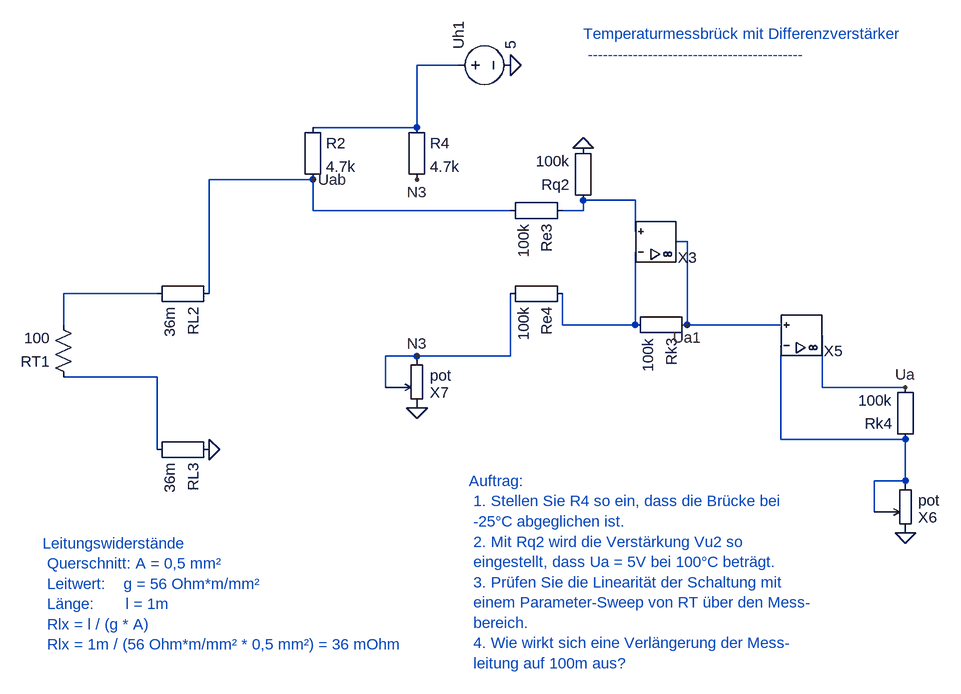
[diagram p0: schematic 1_3_2_PT100-Sensor_mit_Brueckenschaltung.asc]
1_3_2_PT100-Sensor_mit_Brueckenschaltung.asc, the LTspice schematic file:
Version 4
SHEET 1 880 680
WIRE 480 288 320 288
WIRE 320 288 320 464
WIRE 480 288 480 336
WIRE 480 336 784 336
WIRE 640 560 592 560
WIRE 592 560 592 608
WIRE 640 560 784 560
WIRE 784 560 784 464
WIRE 1200 544 1200 688
WIRE 1200 688 1392 688
WIRE 1392 688 1392 752
WIRE 1392 752 1344 752
WIRE 1344 752 1344 800
WIRE 704 112 640 112
WIRE 640 112 640 208
WIRE 640 208 480 208
WIRE 1056 512 1056 384
WIRE 1056 384 1040 384
WIRE 1056 512 1200 512
WIRE 96 592 240 592
WIRE 240 592 240 704
WIRE 976 512 976 400
WIRE 976 512 864 512
WIRE 864 512 864 464
WIRE 1392 608 1264 608
WIRE 1264 608 1264 528
WIRE 240 464 96 464
WIRE 96 464 96 512
WIRE 864 336 896 336
WIRE 896 336 896 320
WIRE 896 320 976 320
WIRE 976 320 976 368
FLAG 784 112 0
FLAG 896 240 0
FLAG 1392 832 0
FLAG 320 704 0
FLAG 640 640 0
FLAG 640 560 N3
FLAG 640 288 N3
FLAG 1056 512 Ua1
FLAG 1392 608 Ua
FLAG 480 288 Uab
SYMBOL opamp 1008 384 M180
SYMATTR InstName X3
SYMATTR Prefix X
SYMATTR SpiceModel opamp
SYMBOL res 112 608 R180
SYMATTR InstName RT1
SYMATTR Value 100
SYMBOL Misc\EuropeanResistor 336 448 R90
SYMATTR InstName RL2
SYMATTR Value 36m
SYMBOL Misc\EuropeanResistor 336 688 R90
SYMATTR InstName RL3
SYMATTR Value 36m
SYMBOL Misc\EuropeanResistor 880 320 R90
SYMATTR InstName Re3
SYMATTR Value 100k
SYMBOL voltage 688 112 R270
SYMATTR InstName Uh1
SYMATTR Value 5
SYMBOL Misc\EuropeanResistor 464 192 R0
SYMATTR InstName R2
SYMATTR Value 4.7k
SYMBOL Misc\EuropeanResistor 624 192 R0
SYMATTR InstName R4
SYMATTR Value 4.7k
SYMBOL Misc\EuropeanResistor 912 336 R180
SYMATTR InstName Rq2
SYMATTR Value 100k
SYMBOL Misc\EuropeanResistor 1072 496 R90
SYMATTR InstName Rk3
SYMATTR Value 100k
SYMBOL Misc\EuropeanResistor 880 448 R90
SYMATTR InstName Re4
SYMATTR Value 100k
SYMBOL opamp 1232 528 M180
SYMATTR InstName X5
SYMATTR Prefix X
SYMATTR SpiceModel opamp
SYMBOL Misc\EuropeanResistor 1408 704 R180
SYMATTR InstName Rk4
SYMATTR Value 100k
SYMBOL pot 1408 848 R180
SYMATTR InstName X6
SYMATTR SpiceLine Rtot=2k wiper=1
SYMATTR Prefix X
SYMATTR SpiceModel pot
SYMBOL pot 656 656 R180
SYMATTR InstName X7
SYMATTR SpiceLine Rtot=100 wiper=0.90375
SYMATTR Prefix X
SYMATTR SpiceModel pot
TEXT 64 848 Left 2 ;Leitungswiderstände \n Querschnitt: A = 0,5 mm² \n Leitwert:    g = 56 Ohm*m/mm² \n Länge:       l = 1m \n Rlx = l / (g * A) \n Rlx = 1m / (56 Ohm*m/mm² * 0,5 mm²) = 36 mOhm
TEXT 720 752 Left 2 ;Auftrag: \n 1. Stellen Sie R4 so ein, dass die Brücke bei \n -25°C abgeglichen ist. \n 2. Mit Rq2 wird die Verstärkung Vu2 so \n eingestellt, dass Ua = 5V bei 100°C beträgt. \n 3. Prüfen Sie die Linearität der Schaltung mit \n einem Parameter-Sweep von RT über den Mess- \n bereich. \n 4. Wie wirkt sich eine Verlängerung der Mess- \n leitung auf 100m aus?
TEXT 896 64 Left 2 ;Temperaturmessbrück mit Differenzverstärker \n -------------------------------------------

The netlist it stands for:
* 1_3_2_PT100-Sensor_mit_Brueckenschaltung.asc
XX3 N006 N004 Ua1 opamp opamp  ; pins In+ In- OUT
RT1 N003 N005 100
RL2 Uab N005 36m
RL3 0 N003 36m
Re3 N006 Uab 100k
V§Uh1 N002 0 5
R2 N002 Uab 4.7k
R4 N002 N3 4.7k
Rq2 N006 0 100k
Rk3 Ua1 N004 100k
Re4 N004 N3 100k
XX5 Ua1 N001 Ua opamp opamp  ; pins In+ In- OUT
Rk4 N001 Ua 100k
XX6 0 N001 N001 pot pot Rtot=2k wiper=1  ; pins A W B
XX7 0 N3 N3 pot pot Rtot=100 wiper=0.90375  ; pins A W B
* Leitungswiderstände
*  Querschnitt: A = 0,5 mm²
*  Leitwert:    g = 56 Ohm*m/mm²
*  Länge:       l = 1m
*  Rlx = l / (g * A)
*  Rlx = 1m / (56 Ohm*m/mm² * 0,5 mm²) = 36 mOhm
* Auftrag:
*  1. Stellen Sie R4 so ein, dass die Brücke bei
*  -25°C abgeglichen ist.
*  2. Mit Rq2 wird die Verstärkung Vu2 so
*  eingestellt, dass Ua = 5V bei 100°C beträgt.
*  3. Prüfen Sie die Linearität der Schaltung mit
*  einem Parameter-Sweep von RT über den Mess-
*  bereich.
*  4. Wie wirkt sich eine Verlängerung der Mess-
*  leitung auf 100m aus?
* Temperaturmessbrück mit Differenzverstärker
*  -------------------------------------------
.lib opamp.lib
.lib pot.lib
.backanno
.end